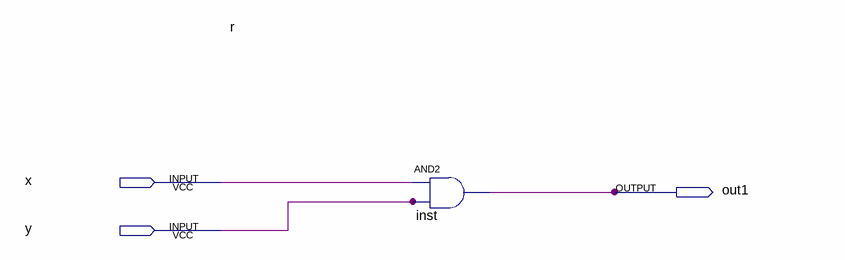
[diagram p0: schematic sheet]
// Quartus schematic ps2opet.bdf as structural Verilog: 1 symbols, 3 pins
module ps2opet (
  input  x,
  input  y,
  output out1
);

  and inst (out1, x, y);

  // Other names for the same wires on the sheet: r = y
endmodule
